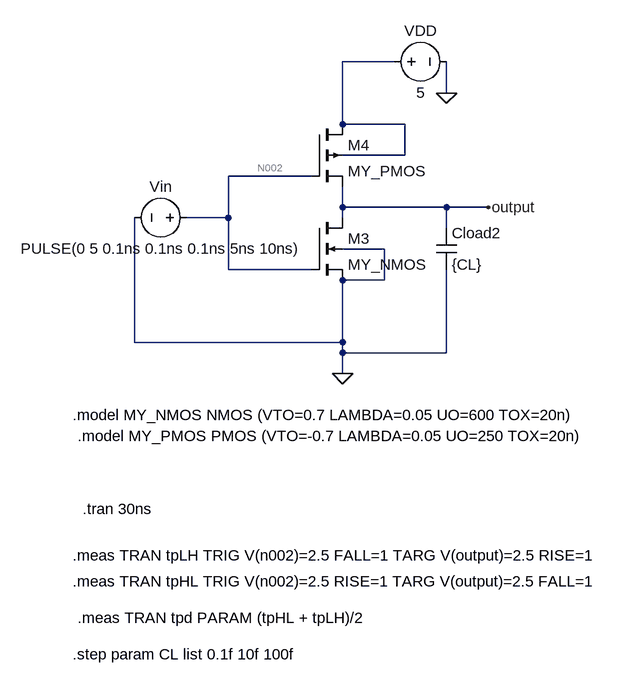
[diagram p0: schematic effect_of_load_capacitance_on_delay.asc]
effect_of_load_capacitance_on_delay.asc, the LTspice schematic file:
Version 4.1
SHEET 1 1600 680
WIRE 1232 -304 1152 -304
WIRE 1312 -256 1312 -304
WIRE 1152 -208 1152 -304
WIRE 1248 -208 1152 -208
WIRE 1248 -160 1248 -208
WIRE 1248 -160 1152 -160
WIRE 1104 -128 976 -128
WIRE 1152 -80 1152 -112
WIRE 1312 -80 1152 -80
WIRE 1376 -80 1312 -80
WIRE 976 -64 976 -128
WIRE 976 -64 912 -64
WIRE 1152 -64 1152 -80
WIRE 1312 -48 1312 -80
WIRE 1216 -16 1152 -16
WIRE 976 16 976 -64
WIRE 1104 16 976 16
WIRE 1216 32 1216 -16
WIRE 1216 32 1152 32
WIRE 832 128 832 -64
WIRE 1152 128 1152 32
WIRE 1152 128 832 128
WIRE 1152 144 1152 128
WIRE 1312 144 1312 16
WIRE 1312 144 1152 144
WIRE 1152 176 1152 144
FLAG 1152 176 0
FLAG 1312 -256 0
FLAG 1376 -80 output
SYMBOL nmos4 1104 -64 R0
SYMATTR InstName M3
SYMATTR Value MY_NMOS
SYMATTR Value2 l=1u w=1u
SYMBOL voltage 928 -64 R90
WINDOW 0 -32 56 VBottom 2
WINDOW 3 32 56 VTop 2
WINDOW 123 0 0 Left 0
WINDOW 39 0 0 Left 0
SYMATTR InstName Vin
SYMATTR Value PULSE(0 5 0.1ns 0.1ns 0.1ns 5ns 10ns)
SYMBOL voltage 1216 -304 R270
WINDOW 0 32 56 VTop 2
WINDOW 3 -32 56 VBottom 2
WINDOW 123 0 0 Left 0
WINDOW 39 0 0 Left 0
SYMATTR InstName VDD
SYMATTR Value 5
SYMBOL cap 1296 -48 R0
SYMATTR InstName Cload2
SYMATTR Value {CL}
SYMBOL pmos4 1104 -208 R0
SYMATTR InstName M4
SYMATTR Value MY_PMOS
SYMATTR Value2 l=1u w=2.4u
TEXT 736 240 Left 2 !.model MY_NMOS NMOS (VTO=0.7 LAMBDA=0.05 UO=600 TOX=20n)
TEXT 744 272 Left 2 !.model MY_PMOS PMOS (VTO=-0.7 LAMBDA=0.05 UO=250 TOX=20n)
TEXT 752 384 Left 2 !.tran 30ns
TEXT 736 456 Left 2 !.meas TRAN tpLH TRIG V(n002)=2.5 FALL=1 TARG V(output)=2.5 RISE=1
TEXT 736 496 Left 2 !.meas TRAN tpHL TRIG V(n002)=2.5 RISE=1 TARG V(output)=2.5 FALL=1
TEXT 744 552 Left 2 !.meas TRAN tpd PARAM (tpHL + tpLH)/2
TEXT 736 608 Left 2 !.step param CL list 0.1f 10f 100f

The netlist it stands for:
* effect_of_load_capacitance_on_delay.asc
M3 output N002 0 0 MY_NMOS l=1u w=1u
Vin N002 0 PULSE(0 5 0.1ns 0.1ns 0.1ns 5ns 10ns)
VDD N001 0 5
Cload2 output 0 {CL}
M4 N001 N002 output N001 MY_PMOS l=1u w=2.4u
.model NMOS NMOS
.model PMOS PMOS
.lib standard.mos
.model MY_NMOS NMOS (VTO=0.7 LAMBDA=0.05 UO=600 TOX=20n)
.model MY_PMOS PMOS (VTO=-0.7 LAMBDA=0.05 UO=250 TOX=20n)
.tran 30ns
.meas TRAN tpLH TRIG V(n002)=2.5 FALL=1 TARG V(output)=2.5 RISE=1
.meas TRAN tpHL TRIG V(n002)=2.5 RISE=1 TARG V(output)=2.5 FALL=1
.meas TRAN tpd PARAM (tpHL + tpLH)/2
.step param CL list 0.1f 10f 100f
.backanno
.end